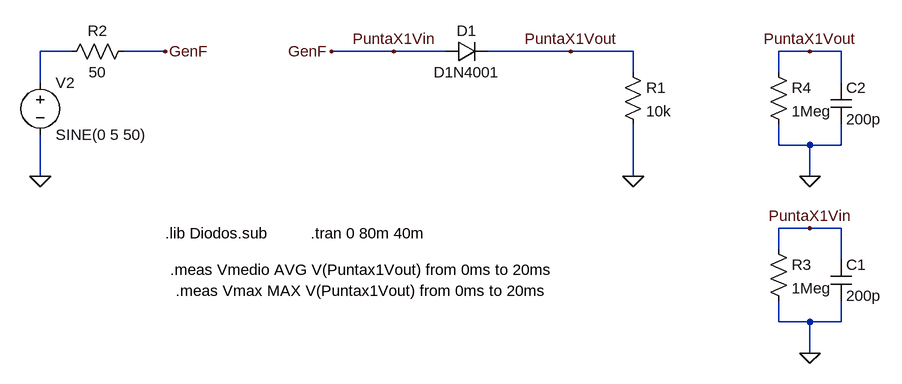
[diagram p0: schematic F_vo_50.asc]
F_vo_50.asc, the LTspice schematic file:
Version 4
SHEET 1 984 680
WIRE -432 64 -480 64
WIRE -288 64 -352 64
WIRE 64 64 -32 64
WIRE 144 64 64 64
WIRE 336 64 208 64
WIRE 432 64 336 64
WIRE 704 64 656 64
WIRE 752 64 704 64
WIRE 432 96 432 64
WIRE 656 96 656 64
WIRE -480 112 -480 64
WIRE 752 112 752 64
WIRE 656 208 656 176
WIRE 704 208 656 208
WIRE 752 208 752 176
WIRE 752 208 704 208
WIRE -480 256 -480 192
WIRE 432 256 432 176
WIRE 704 256 704 208
WIRE 704 336 656 336
WIRE 752 336 704 336
WIRE 656 368 656 336
WIRE 752 384 752 336
WIRE 656 480 656 448
WIRE 704 480 656 480
WIRE 752 480 752 448
WIRE 752 480 704 480
WIRE 704 528 704 480
FLAG 432 256 0
FLAG -480 256 0
FLAG -288 64 GenF
FLAG -32 64 GenF
FLAG 704 256 0
FLAG 704 64 PuntaX1Vout
FLAG 336 64 PuntaX1Vout
FLAG 704 528 0
FLAG 704 336 PuntaX1Vin
FLAG 64 64 PuntaX1Vin
SYMBOL diode 144 80 R270
WINDOW 0 32 32 VTop 2
WINDOW 3 0 32 VBottom 2
SYMATTR InstName D1
SYMATTR Value D1N4001
SYMBOL res 416 80 R0
SYMATTR InstName R1
SYMATTR Value 10k
SYMBOL voltage -480 96 R0
WINDOW 123 0 0 Left 2
WINDOW 39 0 0 Left 2
SYMATTR InstName V2
SYMATTR Value SINE(0 5 50)
SYMBOL res -448 80 R270
WINDOW 0 32 56 VTop 2
WINDOW 3 0 56 VBottom 2
SYMATTR InstName R2
SYMATTR Value 50
SYMBOL res 640 80 R0
SYMATTR InstName R4
SYMATTR Value 1Meg
SYMBOL cap 736 112 R0
SYMATTR InstName C2
SYMATTR Value 200p
SYMBOL res 640 352 R0
SYMATTR InstName R3
SYMATTR Value 1Meg
SYMBOL cap 736 384 R0
SYMATTR InstName C1
SYMATTR Value 200p
TEXT -288 344 Left 2 !.lib Diodos.sub
TEXT -64 344 Left 2 !.tran 0 80m 40m
TEXT -280 400 Left 2 !.meas Vmedio AVG V(Puntax1Vout) from 0ms to 20ms
TEXT -272 432 Left 2 !.meas Vmax MAX V(Puntax1Vout) from 0ms to 20ms

The netlist it stands for:
* F_vo_50.asc
D1 PuntaX1Vin PuntaX1Vout D1N4001
R1 PuntaX1Vout 0 10k
V2 N001 0 SINE(0 5 50)
R2 N001 PuntaX1Vin 50
R4 PuntaX1Vout 0 1Meg
C2 PuntaX1Vout 0 200p
R3 PuntaX1Vin 0 1Meg
C1 PuntaX1Vin 0 200p
.model D D
.lib standard.dio
.lib Diodos.sub
.tran 0 80m 40m
.meas Vmedio AVG V(Puntax1Vout) from 0ms to 20ms
.meas Vmax MAX V(Puntax1Vout) from 0ms to 20ms
.backanno
.end